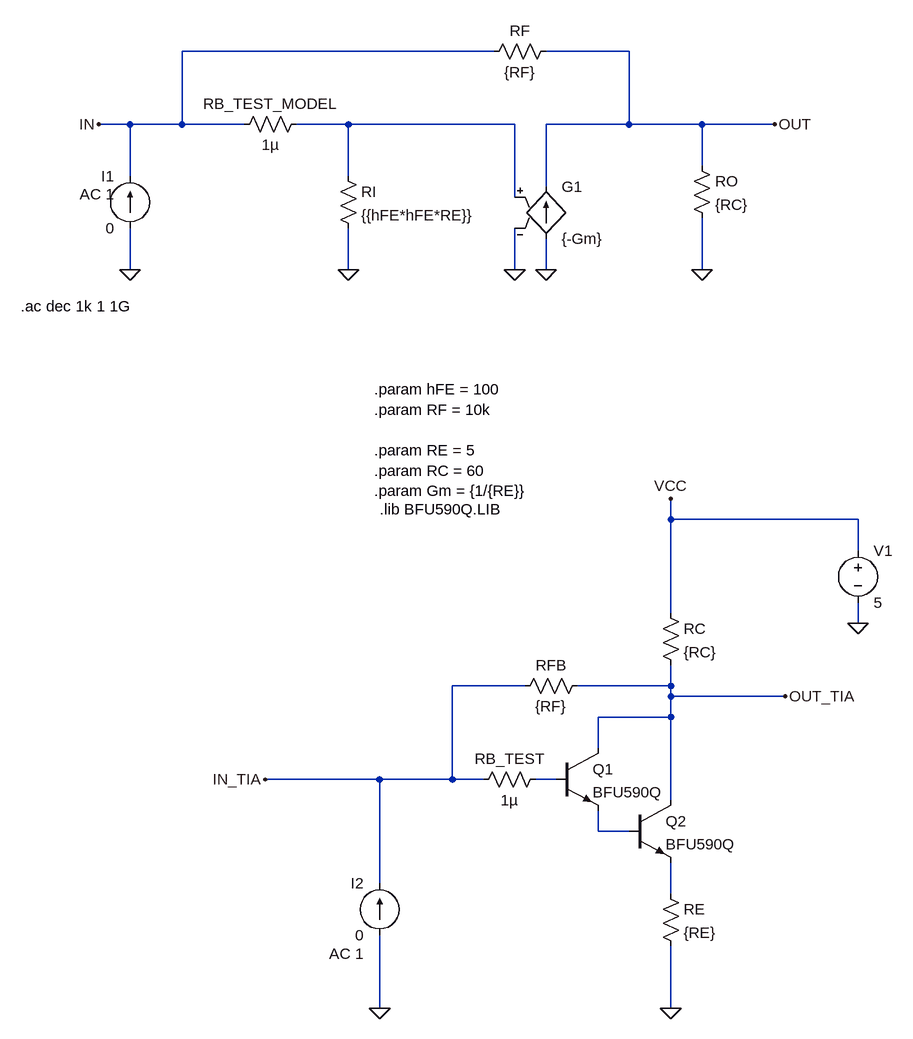
[diagram p0: schematic TIA_Small_Signal_Model.asc]
TIA_Small_Signal_Model.asc, the LTspice schematic file:
Version 4
SHEET 1 880 1252
WIRE 224 -240 -256 -240
WIRE 432 -240 304 -240
WIRE -336 -128 -384 -128
WIRE -256 -128 -256 -240
WIRE -256 -128 -336 -128
WIRE -160 -128 -256 -128
WIRE 0 -128 -80 -128
WIRE 256 -128 0 -128
WIRE 432 -128 432 -240
WIRE 432 -128 304 -128
WIRE 544 -128 432 -128
WIRE 656 -128 544 -128
WIRE 544 -64 544 -128
WIRE -336 -48 -336 -128
WIRE 0 -48 0 -128
WIRE 304 -32 304 -128
WIRE 256 -16 256 -128
WIRE -336 96 -336 32
WIRE 0 96 0 32
WIRE 256 96 256 32
WIRE 304 96 304 48
WIRE 544 96 544 16
WIRE 496 480 496 448
WIRE 784 480 496 480
WIRE 784 528 784 480
WIRE 496 624 496 480
WIRE 784 640 784 608
WIRE 272 736 160 736
WIRE 496 736 496 704
WIRE 496 736 352 736
WIRE 496 752 496 736
WIRE 672 752 496 752
WIRE 496 784 496 752
WIRE 496 784 384 784
WIRE 384 832 384 784
WIRE 48 880 -128 880
WIRE 160 880 160 736
WIRE 160 880 48 880
WIRE 208 880 160 880
WIRE 320 880 288 880
WIRE 496 912 496 784
WIRE 384 960 384 928
WIRE 432 960 384 960
WIRE 48 1040 48 880
WIRE 496 1056 496 1008
WIRE 48 1232 48 1120
WIRE 496 1232 496 1136
FLAG 544 96 0
FLAG 304 96 0
FLAG -336 96 0
FLAG 256 96 0
FLAG 0 96 0
FLAG 656 -128 OUT
FLAG -384 -128 IN
FLAG 496 1232 0
FLAG 496 448 VCC
FLAG 784 640 0
FLAG 48 1232 0
FLAG -128 880 IN_TIA
FLAG 672 752 OUT_TIA
DATAFLAG 608 752 ""
DATAFLAG 160 880 ""
DATAFLAG 160 880 ""
DATAFLAG 496 1040 ""
SYMBOL g 304 -48 R0
SYMATTR InstName G1
SYMATTR Value {-Gm}
SYMBOL res 528 -80 R0
SYMATTR InstName RO
SYMATTR Value {RC}
SYMBOL res -16 -64 R0
SYMATTR InstName RI
SYMATTR Value {{hFE*hFE*RE}}
SYMBOL res 320 -256 R90
WINDOW 0 0 56 VBottom 2
WINDOW 3 32 56 VTop 2
SYMATTR InstName RF
SYMATTR Value {RF}
SYMBOL current -336 32 R180
WINDOW 0 24 80 Left 2
WINDOW 3 24 0 Left 2
WINDOW 123 24 52 Left 2
WINDOW 39 0 0 Left 0
SYMATTR InstName I1
SYMATTR Value 0
SYMATTR Value2 AC 1
SYMBOL npn 320 832 R0
SYMATTR InstName Q1
SYMATTR Value BFU590Q
SYMBOL npn 432 912 R0
SYMATTR InstName Q2
SYMATTR Value BFU590Q
SYMBOL res 480 1040 R0
SYMATTR InstName RE
SYMATTR Value {RE}
SYMBOL voltage 784 512 R0
WINDOW 123 0 0 Left 0
WINDOW 39 0 0 Left 0
SYMATTR InstName V1
SYMATTR Value 5
SYMBOL res 480 608 R0
SYMATTR InstName RC
SYMATTR Value {RC}
SYMBOL current 48 1120 R180
WINDOW 0 24 80 Left 2
WINDOW 3 24 0 Left 2
WINDOW 123 24 -28 Left 2
WINDOW 39 0 0 Left 0
SYMATTR InstName I2
SYMATTR Value 0
SYMATTR Value2 AC 1
SYMBOL res 256 752 R270
WINDOW 0 32 56 VTop 2
WINDOW 3 0 56 VBottom 2
SYMATTR InstName RFB
SYMATTR Value {RF}
SYMBOL res 192 896 R270
WINDOW 0 32 56 VTop 2
WINDOW 3 0 56 VBottom 2
SYMATTR InstName RB_TEST
SYMATTR Value 1µ
SYMBOL res -64 -144 R90
WINDOW 0 0 56 VBottom 2
WINDOW 3 32 56 VTop 2
SYMATTR InstName RB_TEST_MODEL
SYMATTR Value 1µ
TEXT 40 280 Left 2 !.param hFE = 100\n.param RF = 10k\n \n.param RE = 5\n.param RC = 60\n.param Gm = {1/{RE}}
TEXT -504 152 Left 2 !.ac dec 1k 1 1G
TEXT 48 464 Left 2 !.lib BFU590Q.LIB

The netlist it stands for:
* TIA_Small_Signal_Model.asc
G1 0 OUT N001 0 {-Gm}
RO OUT 0 {RC}
RI N001 0 {{hFE*hFE*RE}}
RF OUT IN {RF}
I1 0 IN 0 AC 1
Q1 OUT_TIA N002 N003 0 BFU590Q
Q2 OUT_TIA N003 N004 0 BFU590Q
RE N004 0 {RE}
V1 VCC 0 5
RC VCC OUT_TIA {RC}
I2 0 IN_TIA 0 AC 1
RFB IN_TIA OUT_TIA {RF}
RB_TEST IN_TIA N002 1µ
RB_TEST_MODEL N001 IN 1µ
.model NPN NPN
.model PNP PNP
.lib standard.bjt
.param hFE = 100
.param RF = 10k
.param RE = 5
.param RC = 60
.param Gm = {1/{RE}}
.ac dec 1k 1 1G
.lib BFU590Q.LIB
.backanno
.end